# Altium schematic sheet TLM_002_DS3231SN_RTC.SchDoc: =DocumentName
size A4; CompanyName: Scopa Industries LLC; Engineer: Nazar Lysenko / Andrii Antonenko; Organization: Scopa Industries LLC; Address1: Kyiv; Address2: Ukraine; Address3: https://www.scopa.industries/; Address4: oleksyi.y@scopa.industries; SheetNumber: 7; SheetTotal: 11
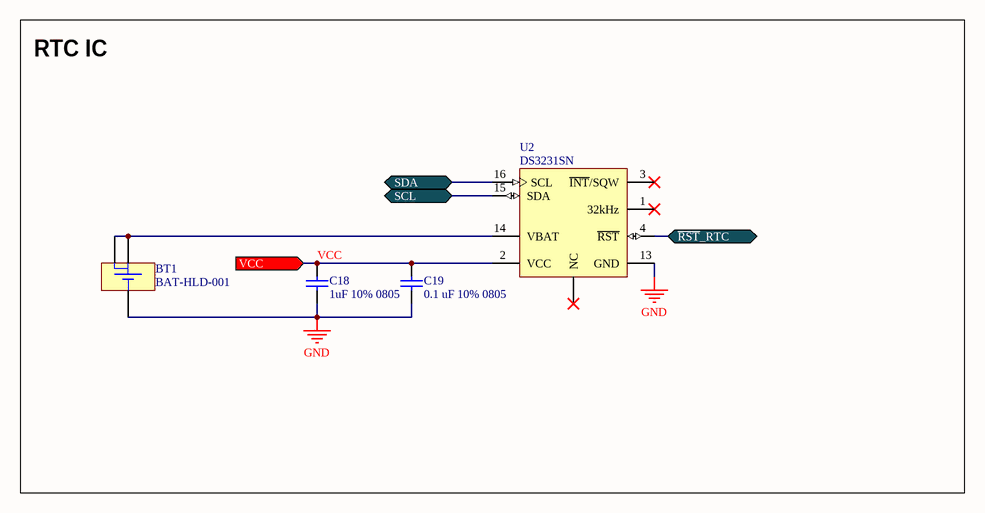
[diagram p0: TLM_002_DS3231SN_RTC.SchDoc]

## Parts
BT1  BAT-HLD-001  [BATHLD-001]
C18  1uF 10% 0805  [CAPC2013X145X50NL20T20]
C19  0.1 uF 10% 0805  [CAPC2013X140X50ML20T25]
U2  DS3231SN  [W16#H2_N]

## Ports
SCL (bidir, see TLM_002_MBR[2B], TLM_002_CONNECT[1B], TLM_002_ESP32S3[2B], TLM_002_INA228[2B], TLM_002_MCP3021[4B]), SDA (bidir, see TLM_002_MBR[2B], TLM_002_CONNECT[1B], TLM_002_ESP32S3[2B], TLM_002_INA228[2B], TLM_002_MCP3021[3B]), VCC (in, see TLM_002_MBR[2B], TLM_002_ESP32S3[1A], TLM_002_INA228[1B], TLM_002_LoRa[2B], TLM_002_MAX6675[2B], TLM_002_MAX31856[1B], TLM_002_MCP3021[3B], TLM_002_SD[1B]), ~{RST}_RTC (bidir, see TLM_002_MBR[2B], TLM_002_ESP32S3[3B])

## Nets
GND: BT1.1(-) C18.1 C19.1 U2.13(GND)
~{RST}_RTC: U2.4(~{RST}) ; port ~{RST}_RTC
SCL: U2.15(SDA) ; port SCL
SDA: U2.16(SCL) ; port SDA
VCC: C18.2 C19.2 U2.2(VCC) ; port VCC
NetBT1_2: BT1.2(+) BT1.3(+) U2.14(VBAT)

Not connected (* = marked no-connect by the designer): U2 1(32kHz)* 3(~{INT}/SQW)* 5(NC)*

## Notes on the sheet
- RTC IC DS3231
- Title
- Size:
- Date:
- A4
- Author:
- Time:
- Sheet
- Revision:
- of
- File:

## Library data of the parts
BT1 = CMP-0168-00043-1: 20mm Coin Cell Battery Holder; PCB_Layout: Complies with manufacturer's recommendation.; DatasheetVersion: rev1.0, Dec-2007; PackageVersion: rev1.0, Dec-2007; PackageReference: BATHLD-001; PackageDescription: Low Profile SM Battery Holder, 20mm Lithium Cell, 21.1 x 15.3 x 4.2 mm Body
C18 = CMP-2007-01676-1: Part Number: VJ0805Y105KXQRW1BC; Manufacturer: Vitramon
C19 = CMP-2007-04651-1: Part Number: 0805DD104KAT2A; Manufacturer: AVX Interconnect / Elco
U2 = CMP-00003-1: DS3231 Series 5.5 V Extremely Accurate I2C-Integrated RTC/TCXO/Crystal - SOIC-16; Manufacturer Lifecycle Status: PRODUCTION; Time Format: HH:MM:SS; Operating Supply Voltage: 3.3V; Min Supply Voltage: 2.3V; Date Format: YY-MM-DD-dd; Interface: I2C; Logic Function: Clock; Frequency: 32.768kHz; Max Supply Voltage: 5.5V; Number of Outputs: 1; Pins: 16; Max Operating Temperature: 85°C; Radiation Hardening: No; Width: 7.6mm; Weight: 665.986997mg; Termination: SMD/SMT; Height: 2.35mm; Lifecycle Status: Production; Length: 10.5mm; Mounting Technology: Surface Mount; REACH SVHC: Unknown; Schedule B: 8542390000; Case/Package: SOIC; Min Operating Temperature: -40°C; RoHS: Compliant; Lead Free: Lead Free